# Altium schematic sheet Relay.SchDoc: Relais 5V
size 296 x 210 mm; DocumentNumber: 4; SheetNumber: 4; SheetTotal: 4
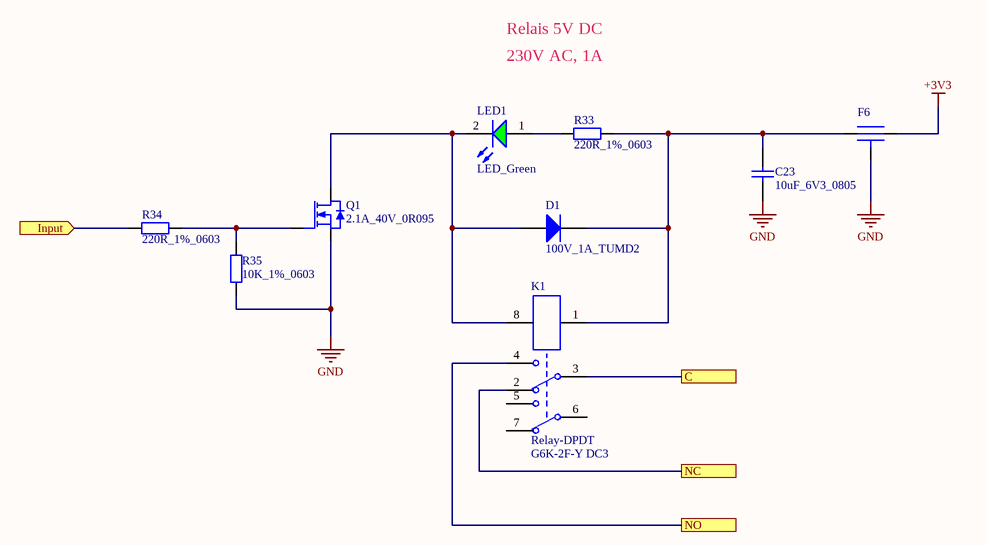
[diagram p0: Relay.SchDoc]

## Parts
C23  10uF_6V3_0805  [C0805]
D1  100V_1A_TUMD2  [TUMD2]
F6  EMI  [EMIFIL_0603]  (value not drawn)
K1  Relay-DPDT  MPN: G6K-2F-Y DC3  [RELAY_G6K_2F_Y]
LED1  LED_Green  [LED_0603_Bright Green]
Q1  2.1A_40V_0R095  [SOT23_N]
R33  220R_1%_0603  [R0603]
R34  220R_1%_0603  [R0603]
R35  10K_1%_0603  [R0603]

## Ports
C, Input (in), NC, NO

## Nets
+3V3: F6.1
GND: C23.1 F6.GND Q1.2(S) R35.1
C: K1.3 ; port C
Input: R34.2 ; port Input
NC: K1.2 ; port NC
NO: K1.4 ; port NO
NetC23_2: C23.2 D1.2(K) F6.2 K1.1 R33.1
NetD1_1: D1.1(A) K1.8 LED1.2(C) Q1.3(D)
NetLED1_1: LED1.1(A) R33.2
NetQ1_1: Q1.1(G) R34.1 R35.2

Not connected (* = marked no-connect by the designer): K1 5(3) 6(1) 7(2)

## Notes on the sheet
- Relais 5V DC
- 230V AC, 1A
- Verified By :
- Approved By :
- Size:
- Sheet:
- Name:
- A4
- /
- Revision:
- Date:
- Engineer:
- Time:

## Library data of the parts
C23 = Cap: Capacitor; MPN: MCTT21X106M6R3CT; MF: MULTICOMP; Supplier 1: Farnell; Supplier Part Number 1: 1759476; Supplier Pricing 1: 0,28 €
D1 = Diode: Default Diode; MPN: MSE1PB-M3/89A; MF: VISHAY; Supplier 1: Farnell; Supplier Part Number 1: 1864881; Supplier Pricing 1: 0,252€
F6 = EMIFIL_0603: FILTER CAP 0.1UF 2A 16V 0603; MPN: NFM18PC104R1C3D; MF: MURATA; Supplier 1: Farnell; Supplier Part Number 1: 1686508; Supplier Pricing 1: 0,083 €
K1 = Relay-DPDT: Dual-Pole Dual-Throw Relay; MF: Omron Electronics; Supplier 1: Digi-Key; Supplier Part Number 1: Z2354-ND; Supplier Pricing 1: 3,43 €
LED1 = WL-SMCW 0603  150060VS75000: SMD mono-color Chip LED, WL-SMCW, Bright Green; MF: Wurth Elektronik; MPN: 150060VS75000; Supplier 1: Farnell; Supplier Part Number 1: 2322073; Supplier Pricing 1: 0,189€
Q1 = MOSFET-N: N-Channel MOSFET; MPN: PMV130ENEA; MF: NEXPERIA; Supplier Pricing 1: 0,342€; Supplier Part Number 1: 2469648; Supplier 1: Farnell
R33 R34 = Res2: Resistor; MPN: MCWR06X2200FTL; MF: MULTICOMP; Supplier 1: Farnell; Supplier Part Number 1: 2447298; Supplier Pricing 1: 0,0059 €
R35 = RES: Resistor; MPN: MCWR06X1002FTL; MF: MULTICOMP; Supplier Pricing 1: 0,0056€; Supplier Part Number 1: 2447230; Supplier 1: Farnell